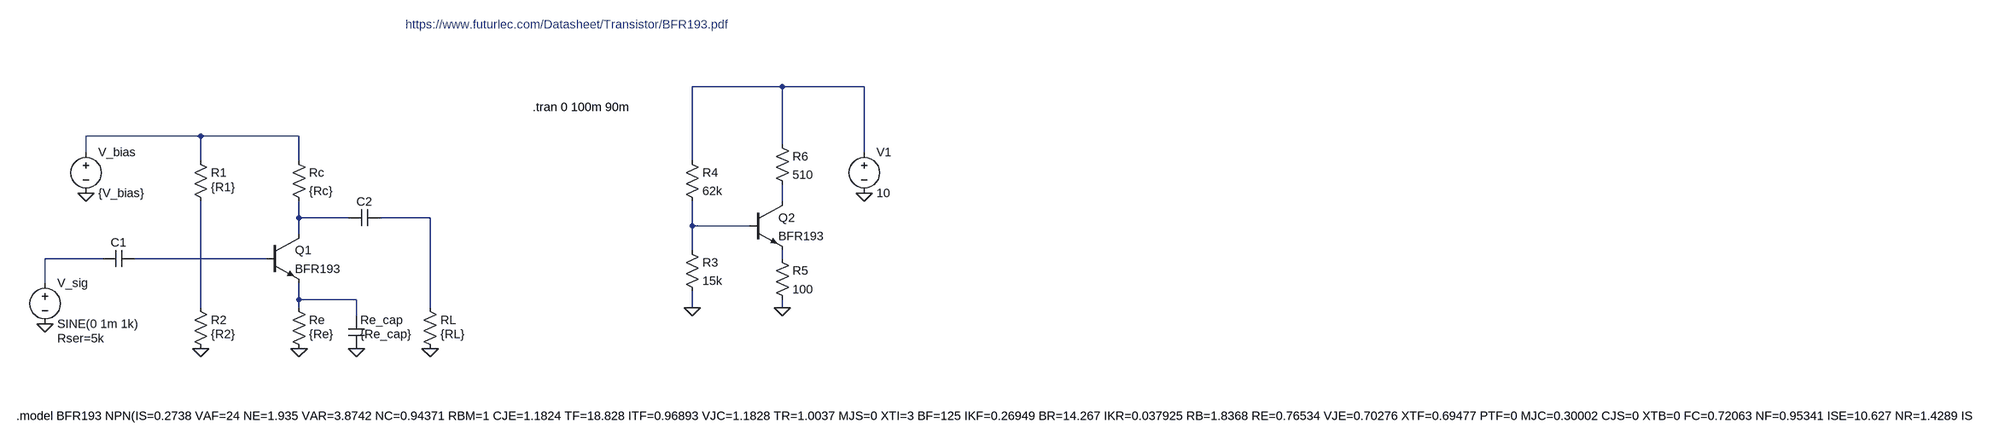
[diagram p0: schematic class-A-220MHz.asc]
class-A-220MHz.asc, the LTspice schematic file:
Version 4
SHEET 1 6464 680
WIRE 1552 -80 1376 -80
WIRE 1712 -80 1552 -80
WIRE 416 16 192 16
WIRE 608 16 416 16
WIRE 1552 32 1552 -80
WIRE 192 48 192 16
WIRE 1712 48 1712 -80
WIRE 416 64 416 16
WIRE 608 64 608 16
WIRE 1376 64 1376 -80
WIRE 1552 144 1552 112
WIRE 608 176 608 144
WIRE 704 176 608 176
WIRE 864 176 768 176
WIRE 1376 192 1376 144
WIRE 1488 192 1376 192
WIRE 608 208 608 176
WIRE 1376 240 1376 192
WIRE 224 256 112 256
WIRE 544 256 288 256
WIRE 1552 256 1552 240
WIRE 112 304 112 256
WIRE 608 336 608 304
WIRE 720 336 608 336
WIRE 416 352 416 144
WIRE 608 352 608 336
WIRE 864 352 864 176
WIRE 1376 352 1376 320
WIRE 1552 352 1552 336
WIRE 720 368 720 336
FLAG 112 384 0
FLAG 416 432 0
FLAG 608 432 0
FLAG 864 432 0
FLAG 192 128 0
FLAG 720 432 0
FLAG 1552 352 0
FLAG 1376 352 0
FLAG 1712 128 0
SYMBOL npn 544 208 R0
SYMATTR InstName Q1
SYMATTR Value BFR193
SYMBOL voltage 112 288 R0
WINDOW 123 0 0 Left 0
WINDOW 39 24 124 Left 2
SYMATTR InstName V_sig
SYMATTR Value SINE(0 1m 1k)
SYMATTR SpiceLine Rser=5k
SYMBOL cap 288 240 R90
WINDOW 0 0 32 VBottom 2
WINDOW 3 32 32 VTop 2
SYMATTR InstName C1
SYMATTR Value ""
SYMBOL res 400 48 R0
WINDOW 3 36 68 Left 2
SYMATTR InstName R1
SYMATTR Value {R1}
SYMBOL res 400 336 R0
WINDOW 3 36 68 Left 2
SYMATTR InstName R2
SYMATTR Value {R2}
SYMBOL res 592 336 R0
WINDOW 3 36 68 Left 2
SYMATTR InstName Re
SYMATTR Value {Re}
SYMBOL res 592 48 R0
SYMATTR InstName Rc
SYMATTR Value {Rc}
SYMBOL cap 768 160 R90
WINDOW 0 0 32 VBottom 2
WINDOW 3 32 32 VTop 2
SYMATTR InstName C2
SYMATTR Value ""
SYMBOL res 848 336 R0
WINDOW 3 36 68 Left 2
SYMATTR InstName RL
SYMATTR Value {RL}
SYMBOL voltage 192 32 R0
WINDOW 123 0 0 Left 0
WINDOW 39 24 124 Left 2
SYMATTR InstName V_bias
SYMATTR Value {V_bias}
SYMBOL cap 704 368 R0
WINDOW 3 24 36 Left 2
SYMATTR InstName Re_cap
SYMATTR Value {Re_cap}
SYMBOL res 1360 224 R0
SYMATTR InstName R3
SYMATTR Value 15k
SYMBOL res 1360 48 R0
SYMATTR InstName R4
SYMATTR Value 62k
SYMBOL npn 1488 144 R0
SYMATTR InstName Q2
SYMATTR Value BFR193
SYMBOL res 1536 240 R0
SYMATTR InstName R5
SYMATTR Value 100
SYMBOL res 1536 16 R0
SYMATTR InstName R6
SYMATTR Value 510
SYMBOL voltage 1712 32 R0
SYMATTR InstName V1
SYMATTR Value 10
TEXT 56 584 Left 2 !.model BFR193 NPN(IS=0.2738 VAF=24 NE=1.935 VAR=3.8742 NC=0.94371 RBM=1 CJE=1.1824 TF=18.828 ITF=0.96893 VJC=1.1828 TR=1.0037 MJS=0 XTI=3 BF=125 IKF=0.26949 BR=14.267 IKR=0.037925 RB=1.8368 RE=0.76534 VJE=0.70276 XTF=0.69477 PTF=0 MJC=0.30002 CJS=0 XTB=0 FC=0.72063 NF=0.95341 ISE=10.627 NR=1.4289 ISC=0.037409 IRB=0.91763 RC=0.11938 MJE=0.48654 VTF=0.8 CJC=935.03 XCJC=0.053563 VJS=0.75 EG=1.11 TNOM=300)
TEXT 1064 -40 Left 2 !.tran 0 100m 90m
TEXT 816 -224 Left 2 ;https://www.futurlec.com/Datasheet/Transistor/BFR193.pdf

The netlist it stands for:
* class-A-220MHz.asc
Q1 N004 N008 N010 0 BFR193
V_sig N007 0 SINE(0 1m 1k) Rser=5k
C1 N008 N007
R1 N002 N011 {R1}
R2 N011 0 {R2}
Re N010 0 {Re}
Rc N002 N004 {Rc}
C2 N005 N004
RL N005 0 {RL}
V_bias N002 0 {V_bias}
C§Re_cap N010 0 {Re_cap}
R3 N006 0 15k
R4 N001 N006 62k
Q2 N003 N006 N009 0 BFR193
R5 N009 0 100
R6 N001 N003 510
V1 N001 0 10
.model NPN NPN
.model PNP PNP
.lib standard.bjt
.model BFR193 NPN(IS=0.2738 VAF=24 NE=1.935 VAR=3.8742 NC=0.94371 RBM=1 CJE=1.1824 TF=18.828 ITF=0.96893 VJC=1.1828 TR=1.0037 MJS=0 XTI=3 BF=125 IKF=0.26949 BR=14.267 IKR=0.037925 RB=1.8368 RE=0.76534 VJE=0.70276 XTF=0.69477 PTF=0 MJC=0.30002 CJS=0 XTB=0 FC=0.72063 NF=0.95341 ISE=10.627 NR=1.4289 ISC=0.037409 IRB=0.91763 RC=0.11938 MJE=0.48654 VTF=0.8 CJC=935.03 XCJC=0.053563 VJS=0.75 EG=1.11 TNOM=300)
.tran 0 100m 90m
* https://www.futurlec.com/Datasheet/Transistor/BFR193.pdf
.backanno
.end